# Altium schematic sheet HRT_D ER100 V1.0.SchDoc: HRT_D ER100 V1.0 Drive
size A3; Date: 2018.6.23; DrawnBy: Qilin Lu; Organization: HRT_D; Address1: ER100 Drive; Address2: 2018.6.23; Address3: Qilin Lu; Revision: 1.0; SheetNumber: 1; SheetTotal: 1
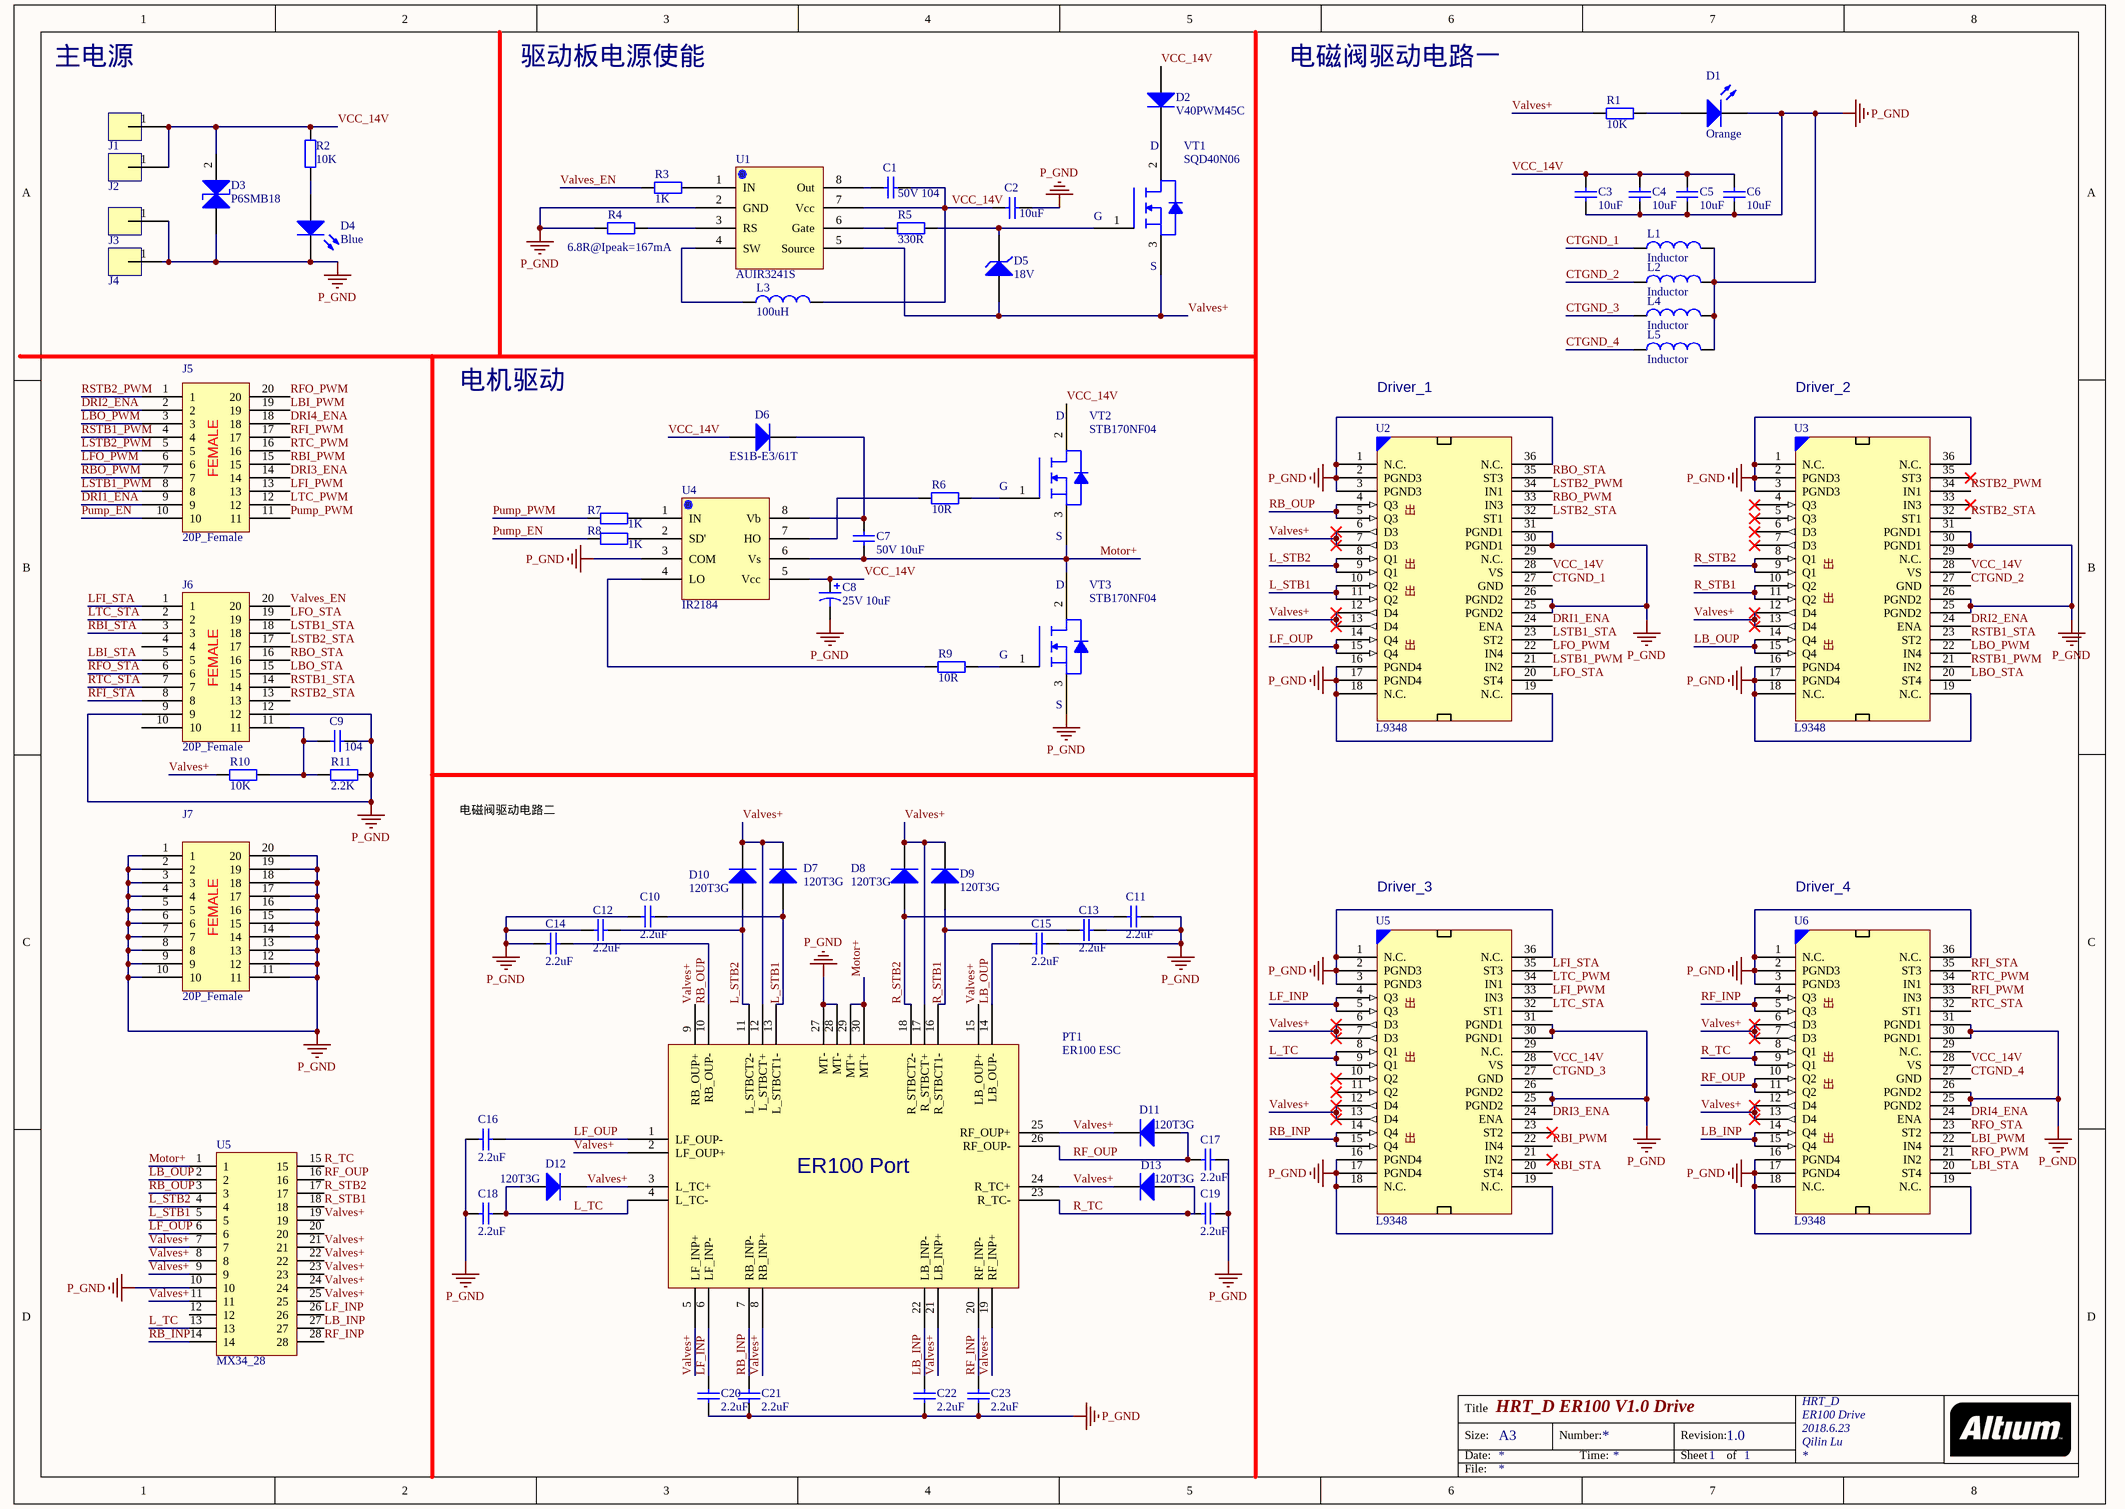
[diagram p0: HRT_D ER100 V1.0.SchDoc]

## Parts
(Parts that share a designator on the sheet are numbered #1, #2 ... from top to bottom, then left to right.)
C1  50V 104  [C 0805]
C2  10uF  [C 0805]
C3  10uF  [C 0805]
C4  10uF  [C 0805]
C5  10uF  [C 0805]
C6  10uF  [C 0805]
C7  50V 10uF  [C 0805]
C8  25V 10uF  [CP 3528B]
C9  104  [C 0805]
C10  2.2uF  [C 0805]
C11  2.2uF  [C 0805]
C12  2.2uF  [C 0805]
C13  2.2uF  [C 0805]
C14  2.2uF  [C 0805]
C15  2.2uF  [C 0805]
C16  2.2uF  [C 0805]
C17  2.2uF  [C 0805]
C18  2.2uF  [C 0805]
C19  2.2uF  [C 0805]
C20  2.2uF  [C 0805]
C21  2.2uF  [C 0805]
C22  2.2uF  [C 0805]
C23  2.2uF  [C 0805]
D1  Orange  [LED_0805]
D2  V40PWM45C  [TO252_DIO]
D3  P6SMB18  [DO-214AA]
D4  Blue  [LED_0805]
D5  18V  [LL34]
D6  ES1B-E3/61T  [DO-214AC]
D7  120T3G  [DO-214AC]
D8  120T3G  [DO-214AC]
D9  120T3G  [DO-214AC]
D10  120T3G  [DO-214AC]
D11  120T3G  [DO-214AC]
D12  120T3G  [DO-214AC]
D13  120T3G  [DO-214AC]
J1  SMT_Connector  [SMT_Connector]  (value not drawn)
J2  SMT_Connector  [SMT_Connector]  (value not drawn)
J3  SMT_Connector  [SMT_Connector]  (value not drawn)
J4  SMT_Connector  [SMT_Connector]  (value not drawn)
J5  20P_Female  [B2B_1.27_Female]
J6  20P_Female  [B2B_1.27_Female]
J7  20P_Female  [B2B_1.27_Female]
L1  Inductor  [L 0805]
L2  Inductor  [L 0805]
L3  100uH  [L 1812]
L4  Inductor  [L 0805]
L5  Inductor  [L 0805]
PT1  ER100 ESC  [ER100 Port]
R1  10K  [R 0603]
R2  10K  [R 0603]
R3  1K  [R 0603]
R4  6.8R@Ipeak=167mA  [R 0805]
R5  330R  [R 0805]
R6  10R  [R 0805]
R7  1K  [R 0603]
R8  1K  [R 0603]
R9  10R  [R 0805]
R10  10K  [R 0805]
R11  2.2K  [R 0805]
U1  AUIR3241S  [SOP8]
U2  L9348  [PowerSO-36]
U3  L9348  [PowerSO-36]
U4  IR2184  [SOP8]
U5#1  MX34_28  [mx34_28]
U5#2  L9348  [PowerSO-36]
U6  L9348  [PowerSO-36]
VT1  SQD40N06  [TO252]
VT2  STB170NF04  [TO263-3B]
VT3  STB170NF04  [TO263-3B]

## Nets
P_GND: C2.1 C3.2 C4.2 C5.2 C6.2 C8.2 C9.1 C10.2 C11.1 C12.2 C13.1 C14.2 C15.1 C16.2 C17.1 C18.2 C19.1 C20.2 C21.2 C22.2 C23.2 D1.2(K) D3.1(A) D4.2(K) J3.1 J4.1 J6.9 J6.12 J7.1 J7.2 J7.3 J7.4 J7.5 J7.6 J7.7 J7.8 J7.9 J7.10 J7.11 J7.12 J7.13 J7.14 J7.15 J7.16 J7.17 J7.18 J7.19 J7.20 L1.2 L2.2 L4.2 L5.2 PT1.27(MT-) PT1.28(MT-) R4.1 R11.2 U1.2(GND) U2.1(N.C.) U2.2(PGND3) U2.3(PGND3) U2.16(PGND4) U2.17(PGND4) U2.18(N.C.) U2.19(N.C.) U2.25(PGND2) U2.26(PGND2) U2.30(PGND1) U2.31(PGND1) U2.36(N.C.) U3.1(N.C.) U3.2(PGND3) U3.3(PGND3) U3.16(PGND4) U3.17(PGND4) U3.18(N.C.) U3.19(N.C.) U3.25(PGND2) U3.26(PGND2) U3.30(PGND1) U3.31(PGND1) U3.36(N.C.) U4.3(COM) U5#1.10 U5#2.1(N.C.) U5#2.2(PGND3) U5#2.3(PGND3) U5#2.16(PGND4) U5#2.17(PGND4) U5#2.18(N.C.) U5#2.19(N.C.) U5#2.25(PGND2) U5#2.26(PGND2) U5#2.30(PGND1) U5#2.31(PGND1) U5#2.36(N.C.) U6.1(N.C.) U6.2(PGND3) U6.3(PGND3) U6.16(PGND4) U6.17(PGND4) U6.18(N.C.) U6.19(N.C.) U6.25(PGND2) U6.26(PGND2) U6.30(PGND1) U6.31(PGND1) U6.36(N.C.) VT3.3
CTGND_1: L1.1 U2.27(GND)
CTGND_2: L2.1 U3.27(GND)
CTGND_3: L4.1 U5#2.27(GND)
CTGND_4: L5.1 U6.27(GND)
DRI1_ENA: J5.9 U2.24(ENA)
DRI2_ENA: J5.2 U3.24(ENA)
DRI3_ENA: J5.14 U5#2.24(ENA)
DRI4_ENA: J5.18 U6.24(ENA)
L_STB1: C10.1 D7.1(A) PT1.13(L_STBCT1-) U2.10(Q2) U2.11(Q2) U5#1.5
L_STB2: C12.1 D10.1(A) PT1.11(L_STBCT2-) U2.8(Q1) U2.9(Q1) U5#1.4
L_TC: C18.1 D12.1(A) PT1.4(L_TC-) U5#1.13 U5#2.8(Q1) U5#2.9(Q1)
LB_INP: C22.1 PT1.22(LB_INP-) U5#1.27 U6.14(Q4) U6.15(Q4)
LB_OUP: C15.2 PT1.14(LB_OUP-) U3.14(Q4) U3.15(Q4) U5#1.2
LBI_PWM: J5.19 U6.22(IN4)
LBI_STA: J6.5 U6.20(ST4)
LBO_PWM: J5.3 U3.22(IN4)
LBO_STA: J6.15 U3.20(ST4)
LF_INP: C20.1 PT1.6(LF_INP-) U5#1.26 U5#2.4(Q3) U5#2.5(Q3)
LF_OUP: C16.1 PT1.1(LF_OUP-) U2.14(Q4) U2.15(Q4) U5#1.6
LFI_PWM: J5.13 U5#2.33(IN3)
LFI_STA: J6.1 U5#2.35(ST3)
LFO_PWM: J5.6 U2.22(IN4)
LFO_STA: J6.19 U2.20(ST4)
LSTB1_PWM: J5.8 U2.21(IN2)
LSTB1_STA: J6.18 U2.23(ST2)
LSTB2_PWM: J5.5 U2.34(IN1)
LSTB2_STA: J6.17 U2.32(ST1)
LTC_PWM: J5.12 U5#2.34(IN1)
LTC_STA: J6.2 U5#2.32(ST1)
Motor+: C7.2 PT1.29(MT+) PT1.30(MT+) U4.6(Vs) U5#1.1 VT2.3 VT3.2
Pump_EN: J5.10 R8.1
Pump_PWM: J5.11 R7.1
R_STB1: C13.2 D9.1(A) PT1.16(R_STBCT1-) U3.10(Q2) U3.11(Q2) U5#1.18
R_STB2: C11.2 D8.1(A) PT1.18(R_STBCT2-) U3.8(Q1) U3.9(Q1) U5#1.17
R_TC: C19.2 D13.1(A) PT1.23(R_TC-) U5#1.15 U6.8(Q1) U6.9(Q1)
RB_INP: C21.1 PT1.7(RB_INP-) U5#1.14 U5#2.14(Q4) U5#2.15(Q4)
RB_OUP: C14.1 PT1.10(RB_OUP-) U2.4(Q3) U2.5(Q3) U5#1.3
RBI_PWM: J5.15 U5#2.22(IN4)
RBI_STA: J6.3 U5#2.20(ST4)
RBO_PWM: J5.7 U2.33(IN3)
RBO_STA: J6.16 U2.35(ST3)
RF_INP: C23.1 PT1.20(RF_INP-) U5#1.28 U6.4(Q3) U6.5(Q3)
RF_OUP: C17.2 D11.1(A) PT1.26(RF_OUP-) U5#1.16 U6.10(Q2) U6.11(Q2)
RFI_PWM: J5.17 U6.33(IN3)
RFI_STA: J6.8 U6.35(ST3)
RFO_PWM: J5.20 U6.21(IN2)
RFO_STA: J6.6 U6.23(ST2)
RSTB1_PWM: J5.4 U3.21(IN2)
RSTB1_STA: J6.14 U3.23(ST2)
RSTB2_PWM: J5.1 U3.34(IN1)
RSTB2_STA: J6.13 U3.32(ST1)
RTC_PWM: J5.16 U6.34(IN1)
RTC_STA: J6.7 U6.32(ST1)
Valves+: D5.1(A) D7.2(K) D8.2(K) D9.2(K) D10.2(K) D11.2(K) D12.2(K) D13.2(K) PT1.2(LF_OUP+) PT1.3(L_TC+) PT1.5(LF_INP+) PT1.8(RB_INP+) PT1.9(RB_OUP+) PT1.12(L_STBCT+) PT1.15(LB_OUP+) PT1.17(R_STBCT+) PT1.19(RF_INP+) PT1.21(LB_INP+) PT1.24(R_TC+) PT1.25(RF_OUP+) R1.1 R10.2 U1.5(Source) U2.6(D3) U2.7(D3) U2.12(D4) U2.13(D4) U3.12(D4) U3.13(D4) U5#1.7 U5#1.8 U5#1.9 U5#1.11 U5#1.19 U5#1.21 U5#1.22 U5#1.23 U5#1.24 U5#1.25 U5#2.6(D3) U5#2.7(D3) U5#2.12(D4) U5#2.13(D4) U6.6(D3) U6.7(D3) U6.12(D4) U6.13(D4) VT1.3
Valves_EN: J6.20 R3.1
VCC_14V: C1.2 C2.2 C3.1 C4.1 C5.1 C6.1 C8.1 D2.1(A) D3.2(K) D6.1(A) J1.1 J2.1 L3.2 R2.2 U1.7(Vcc) U2.28(VS) U3.28(VS) U4.5(Vcc) U5#2.28(VS) U6.28(VS) VT2.2
NetC1_1: C1.1 U1.8(Out)
NetC7_1: C7.1 D6.2(K) U4.8(Vb)
NetC9_2: C9.2 J6.11 R10.1 R11.1
NetD1_1: D1.1(A) R1.2
NetD2_2: D2.2(K) VT1.2
NetD4_1: D4.1(A) R2.1
NetD5_2: D5.2(K) R5.2 VT1.1(G)
NetL3_1: L3.1 U1.4(SW)
NetR3_2: R3.2 U1.1(IN)
NetR4_2: R4.2 U1.3(RS)
NetR5_1: R5.1 U1.6(Gate)
NetR6_1: R6.1 U4.7(HO)
NetR6_2: R6.2 VT2.1(G)
NetR7_2: R7.2 U4.1(IN)
NetR8_2: R8.2 U4.2(SD')
NetR9_1: R9.1 U4.4(LO)
NetR9_2: R9.2 VT3.1(G)

Not connected (* = marked no-connect by the designer): J6 4 10; U2 29(N.C.); U3 4(Q3)* 5(Q3)* 6(D3)* 7(D3)* 29(N.C.) 33(IN3)* 35(ST3)*; U5#1 12 20; U5#2 10(Q2)* 11(Q2)* 21(IN2)* 23(ST2)* 29(N.C.); U6 29(N.C.)

## Notes on the sheet
- 主电源
- 驱动板电源使能
- 电磁阀驱动电路一
- 电机驱动
- Driver_1
- Driver_2
- (near U2) 出
- (near U3) 出
- 电磁阀驱动电路二
- Driver_3
- Driver_4
- (near U5#2) 出
- (near U6) 出
- Title
- Size:
- Date:
- A3
- Number:
- Time:
- Revision:
- Sheet
- of
- File:
- (in symbol B2B_1.27_Female) FEMALE
- (in symbol ER100 ESC) ER100 Port
- (in symbol PowerMos_N) D; S

## Library data of the parts
C1-C7 C9-C23 = Cap: 无极性电容
C8 = Cap_Pol: 极性电容
D1 D4 = LED: 发光二极管
D2 D6-D13 = Diode: 二极管
D3 = P6SMBXX: BiDir TVS Diode
D5 = Diode_Zener
J1-J4 = SMT_Connector: 表贴接线端
J5-J7 = B2B_1.27_Female: 板对板连接器 母头
L1-L5 = Inductor: 电感
PT1 = ER100 ESC: ER100元件接口
R1-R11 = Resistor: 电阻
U1 = AUIR3241S: B2B MOSFET Driver
U2 U3 U5#2 U6 = L9348: 4路电磁阀驱动
U4 = IR2184: Half-Bridge Gate Driver
VT1-VT3 = PowerMos_N